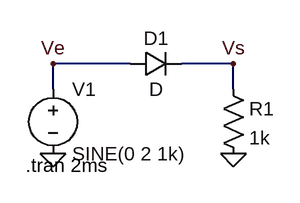
[diagram p0: schematic Draft1.asc]
Draft1.asc, the LTspice schematic file:
Version 4
SHEET 1 880 680
WIRE 160 112 64 112
WIRE 288 112 224 112
WIRE 64 144 64 112
WIRE 288 144 288 112
FLAG 288 224 0
FLAG 64 224 0
FLAG 288 112 Vs
FLAG 64 112 Ve
SYMBOL diode 160 128 R270
WINDOW 0 32 32 VTop 2
WINDOW 3 0 32 VBottom 2
SYMATTR InstName D1
SYMBOL voltage 64 128 R0
WINDOW 123 0 0 Left 0
WINDOW 39 0 0 Left 0
SYMATTR InstName V1
SYMATTR Value SINE(0 2 1k)
SYMBOL res 272 128 R0
SYMATTR InstName R1
SYMATTR Value 1k
TEXT 30 238 Left 2 !.tran 2ms

The netlist it stands for:
* Draft1.asc
D1 Ve Vs D
V1 Ve 0 SINE(0 2 1k)
R1 Vs 0 1k
.model D D
.lib standard.dio
.tran 2ms
.backanno
.end

* Results of the author's LTspice run, read from the files saved beside the schematic
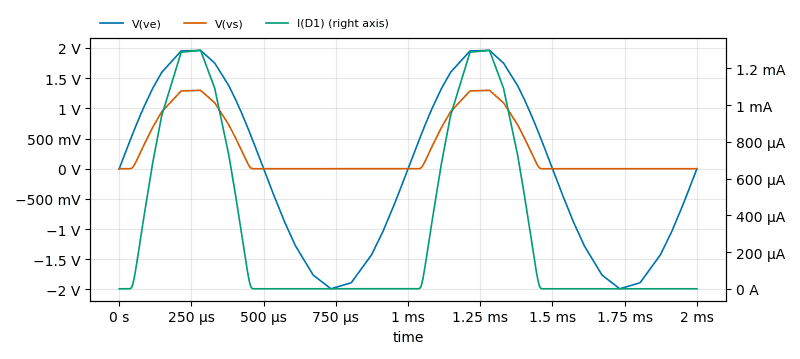
[diagram p1: Transient Analysis of Draft1.asc, plotted from the saved traces]
* Transient Analysis, 1 run:
*   V(ve): min -1.989 V, max 1.96 V, average 2.079 mV, rms 1.403 V, last 0 V
*   V(vs): min 0 V, max 1.298 V, average 341.9 mV, rms 597.7 mV, last 0 V
*   I(D1): min 0 A, max 1.298 mA, average 341.9 µA, rms 597.7 µA, last 0 A